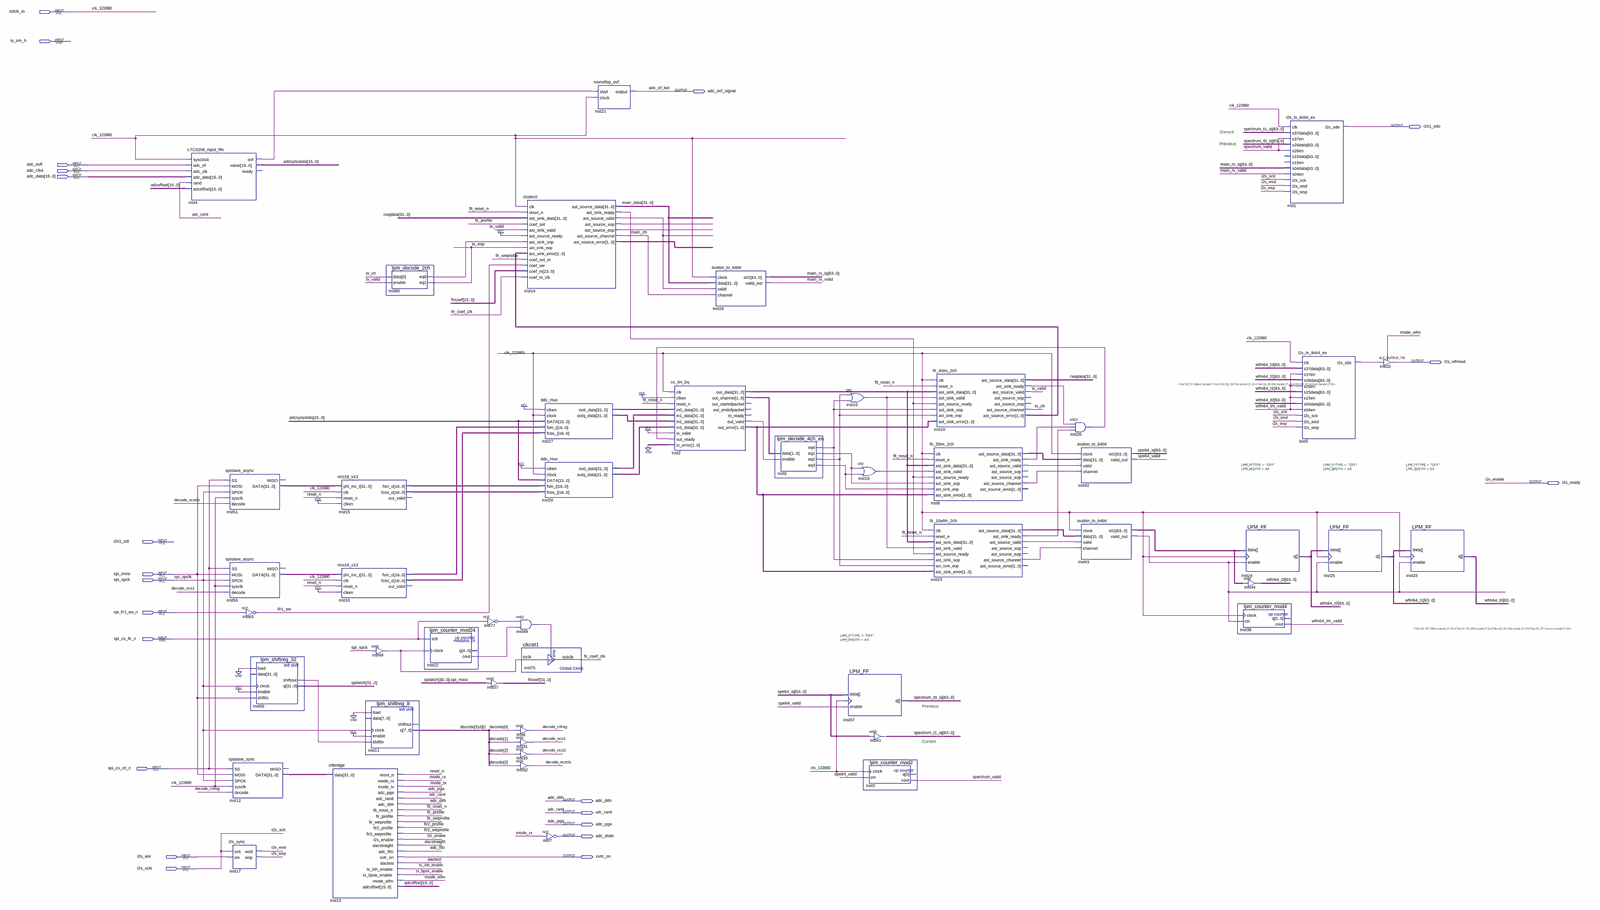
[diagram p0: schematic sheet, whole]
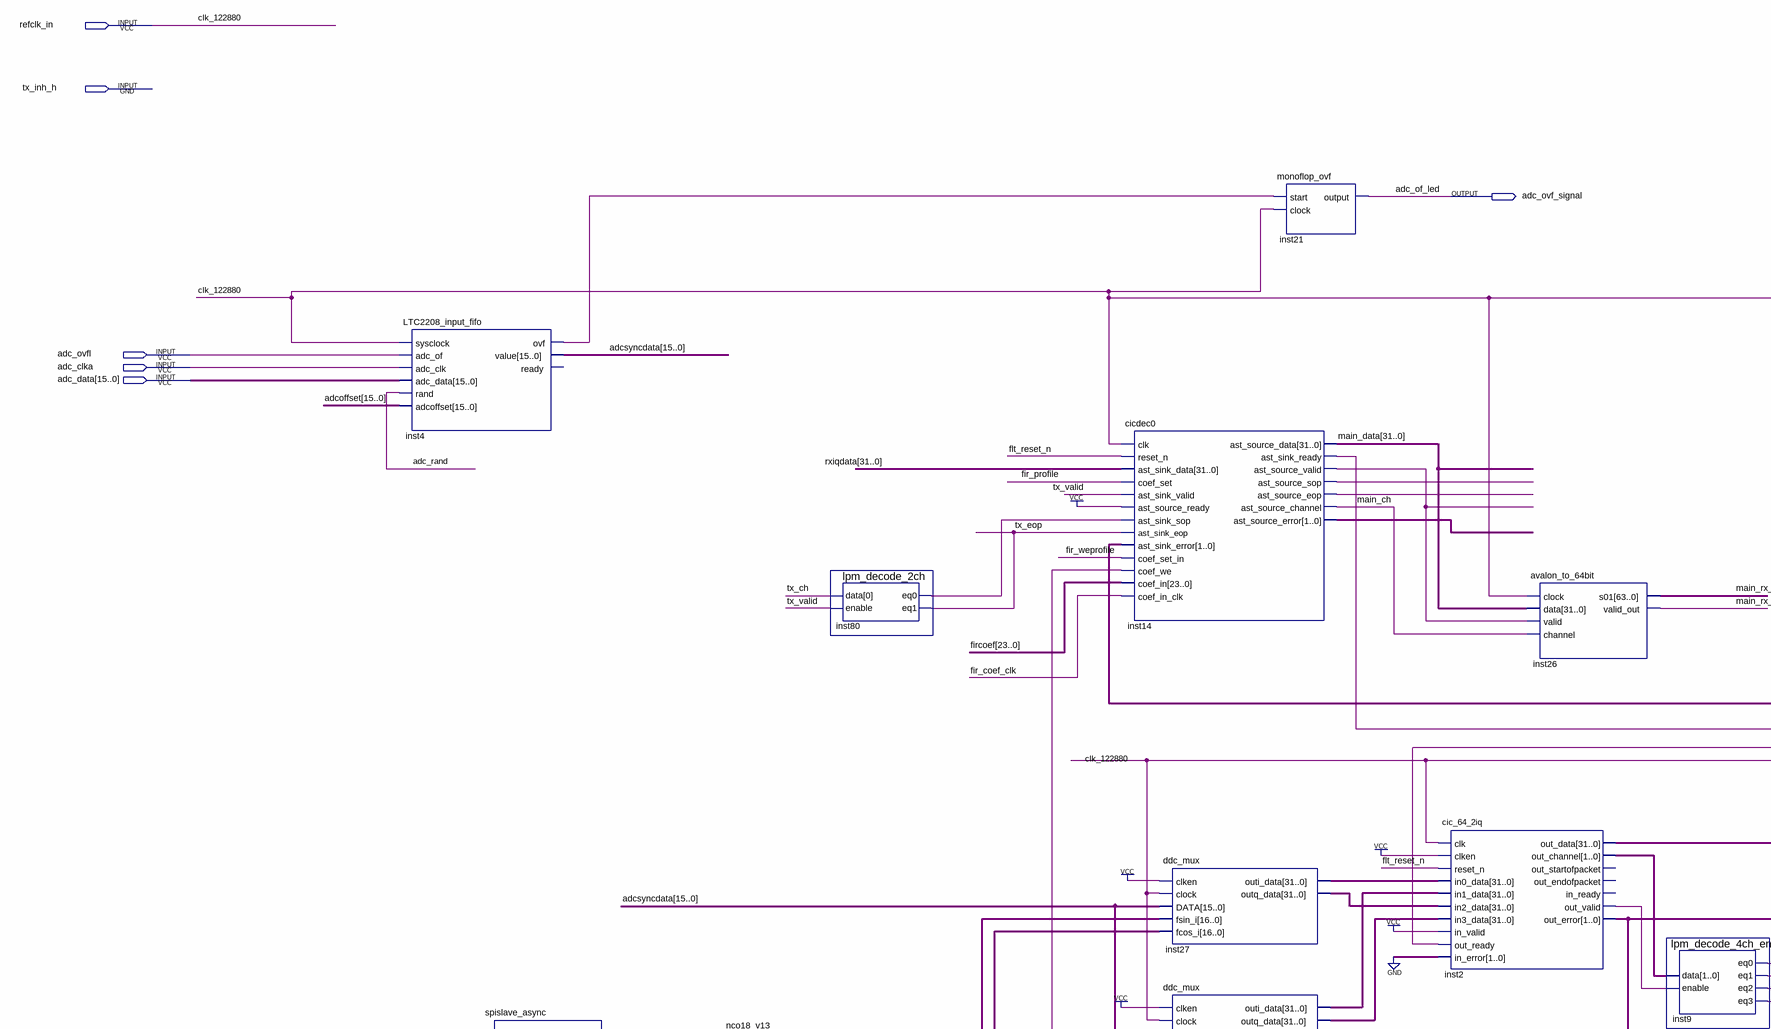
[diagram p1: schematic sheet, upper left part]
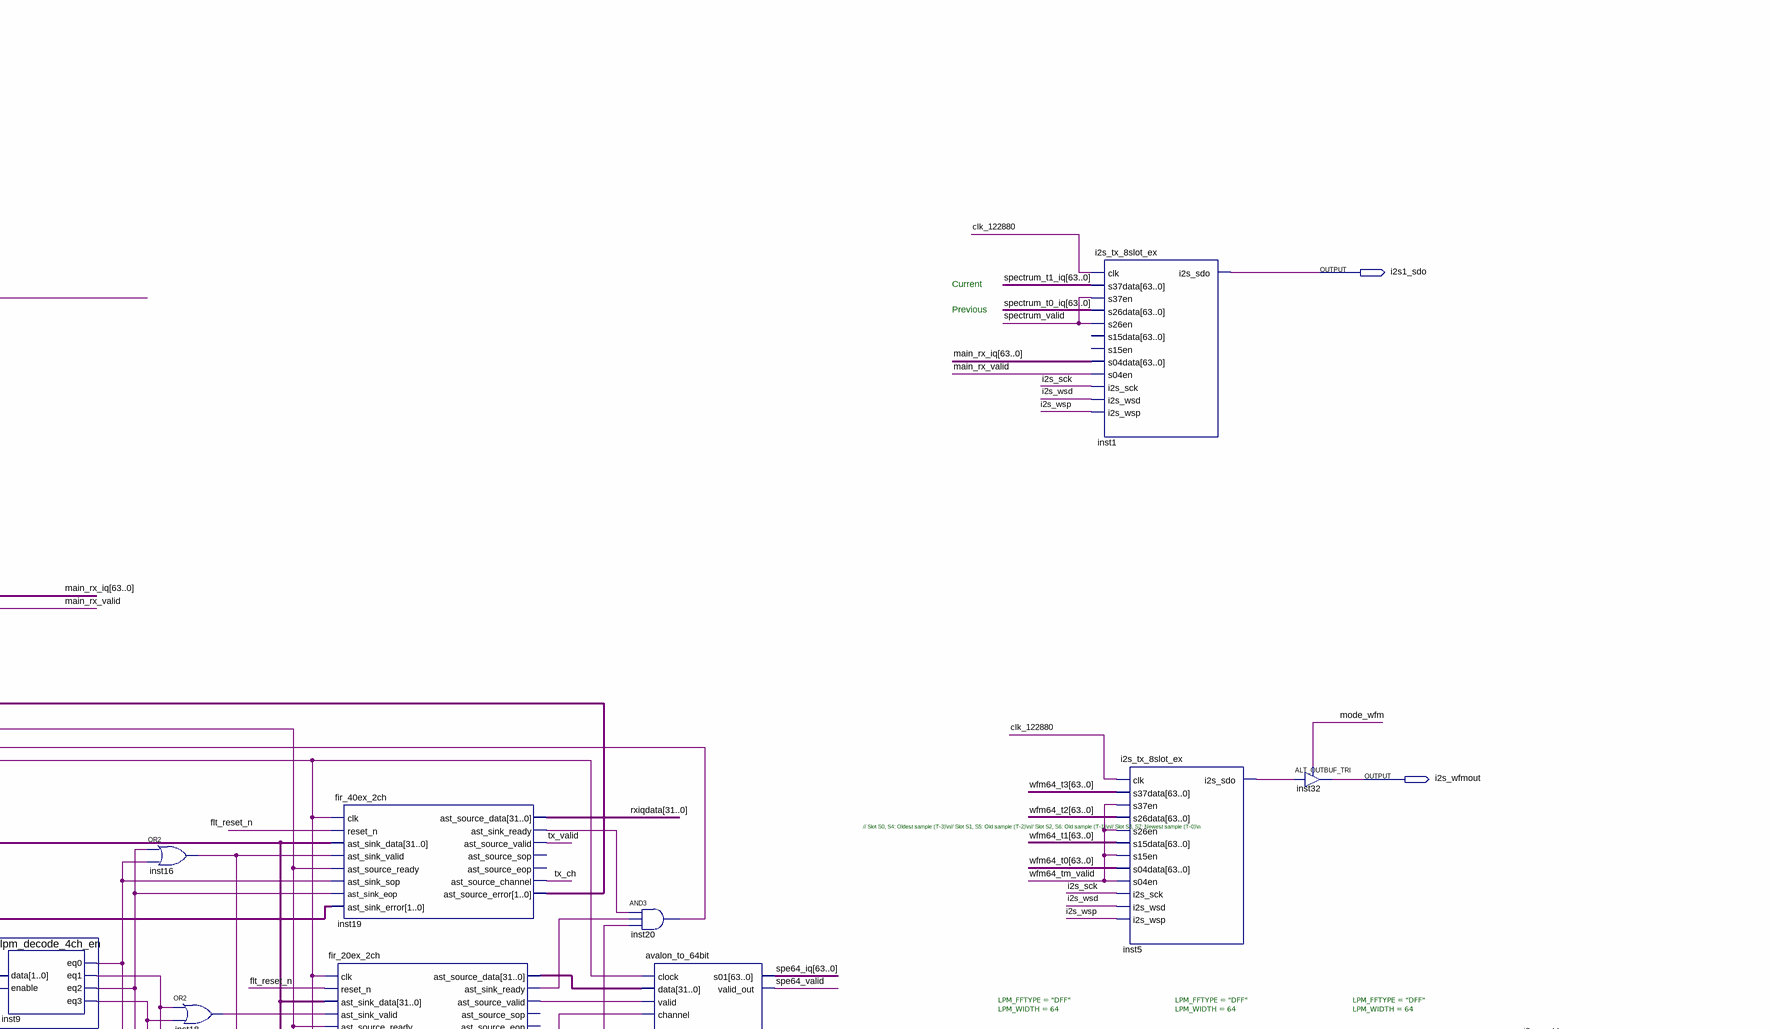
[diagram p2: schematic sheet, upper right part]
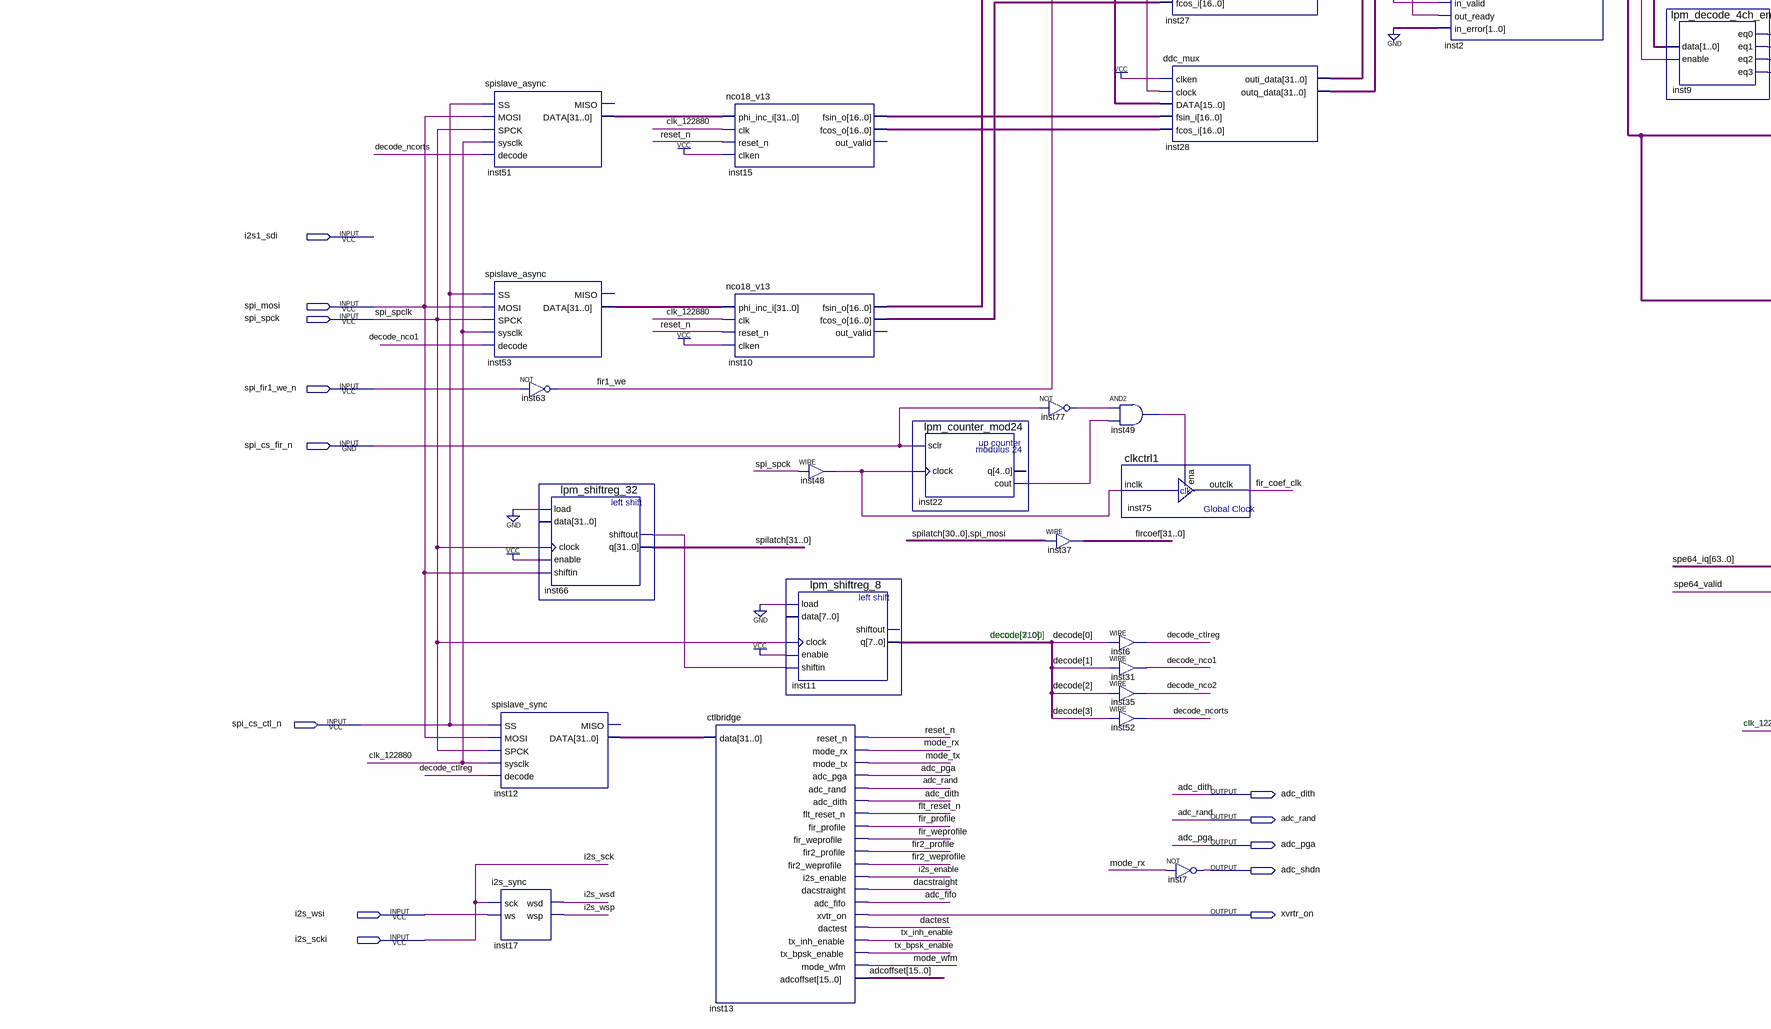
[diagram p3: schematic sheet, lower left part]
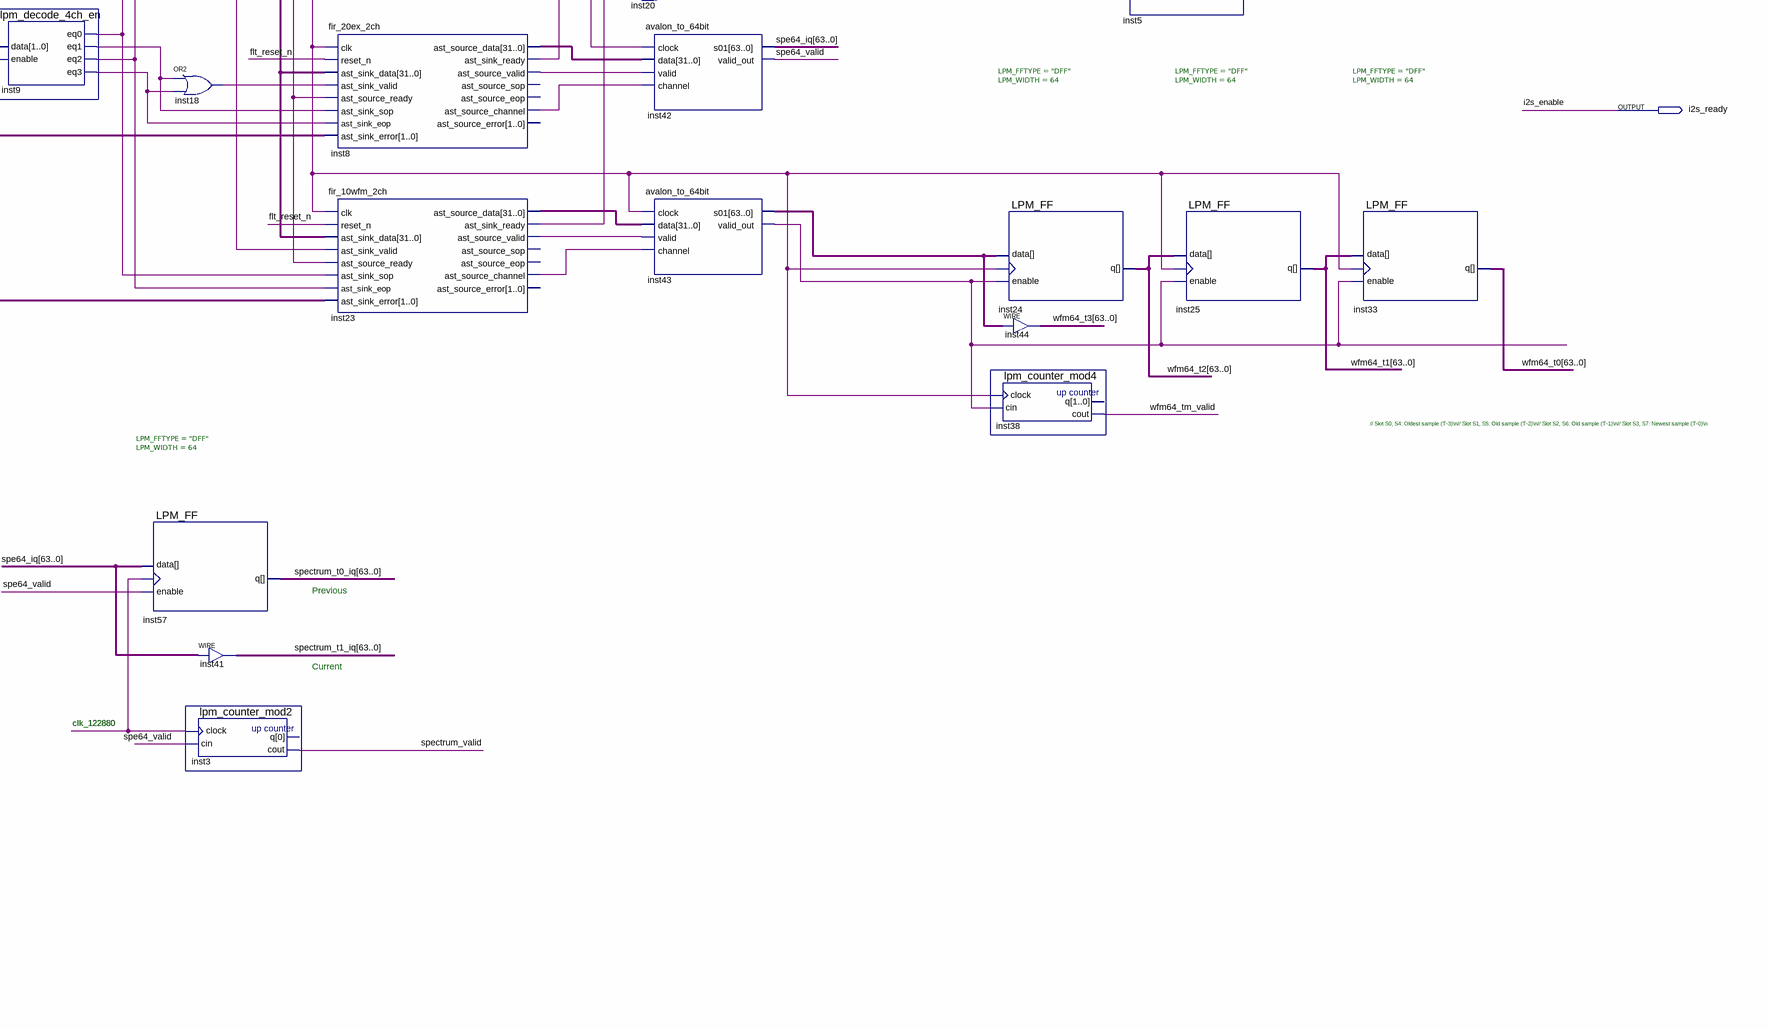
[diagram p4: schematic sheet, lower right part]
// Quartus schematic t1_1ch_wfm.bdf as structural Verilog: 49 symbols, 22 pins
module t1_1ch_wfm (
  input  refclk_in,
  input  tx_inh_h,
  input  adc_ovfl,
  input  adc_clka,
  input  [15:0] adc_data,
  input  i2s1_sdi,
  input  spi_mosi,
  input  spi_spck,
  input  spi_fir1_we_n,
  input  spi_cs_fir_n,
  input  spi_cs_ctl_n,
  input  i2s_wsi,
  input  i2s_scki,
  output adc_ovf_signal,
  output i2s1_sdo,
  output i2s_wfmout,
  output i2s_ready,
  output adc_dith,
  output adc_rand,
  output adc_pga,
  output adc_shdn,
  output xvrtr_on
);

  wire adc_fifo, dacstraight, dactest, decode_ctlreg, decode_nco1, decode_nco2, decode_ncorts, fir1_we,
       fir2_profile, fir2_weprofile, fir_coef_clk, fir_profile, fir_weprofile, flt_reset_n, i2s_wsd, i2s_wsp,
       inst2_out_valid, inst4_ovf, inst5_i2s_sdo, inst8_ast_sink_ready, inst8_ast_source_channel,
       inst8_ast_source_valid, inst9_eq0, inst9_eq1, inst9_eq2, inst9_eq3, inst14_ast_sink_ready,
       inst14_ast_source_eop, inst14_ast_source_sop, inst14_ast_source_valid, inst16_out, inst18_out,
       inst19_ast_sink_ready, inst20_out, inst22_cout, inst23_ast_sink_ready, inst23_ast_source_channel,
       inst23_ast_source_valid, inst43_valid_out, inst48_out, inst49_out, inst66_shiftout, inst77_out,
       inst80_eq0, main_ch, main_rx_valid, mode_rx, mode_tx, mode_wfm, reset_n, spe64_valid, spectrum_valid,
       tx_bpsk_enable, tx_ch, tx_eop, tx_inh_enable, tx_valid, wfm64_tm_valid;
  wire [1:0] inst2_out_channel, inst2_out_error, inst14_ast_source_error, inst19_ast_source_error;
  wire [7:0] decode;
  wire [15:0] adcoffset, adcsyncdata;
  wire [16:0] inst10_fcos_o, inst10_fsin_o, inst15_fcos_o, inst15_fsin_o;
  wire [31:0] fircoef, inst2_out_data, inst8_ast_source_data, inst12_data, inst23_ast_source_data,
       inst27_outi_data, inst27_outq_data, inst28_outi_data, inst28_outq_data, inst51_data, inst53_data,
       main_data, rxiqdata, spilatch;
  wire [63:0] inst43_s01, main_rx_iq, spe64_iq, spectrum_t0_iq, spectrum_t1_iq, wfm64_t0, wfm64_t1, wfm64_t2,
       wfm64_t3;

  LTC2208_input_fifo inst4 (
    .sysclock(refclk_in), .adc_of(adc_ovfl), .adc_clk(adc_clka), .adc_data(adc_data), .\rand (adc_rand),
    .adcoffset(adcoffset), .ovf(inst4_ovf), .value(adcsyncdata));  // open: ready
  spislave_async inst51 (
    .SS(spi_cs_ctl_n), .MOSI(spi_mosi), .SPCK(spi_spck), .sysclk(refclk_in), .decode(decode_ncorts),
    .DATA(inst51_data));  // open: MISO
  spislave_async inst53 (
    .SS(spi_cs_ctl_n), .MOSI(spi_mosi), .SPCK(spi_spck), .sysclk(refclk_in), .decode(decode_nco1),
    .DATA(inst53_data));  // open: MISO
  spislave_sync inst12 (
    .MOSI(spi_mosi), .SPCK(spi_spck), .SS(spi_cs_ctl_n), .decode(decode_ctlreg), .sysclk(refclk_in),
    .DATA(inst12_data));  // open: MISO
  i2s_sync inst17 (.sck(i2s_scki), .ws(i2s_wsi), .wsd(i2s_wsd), .wsp(i2s_wsp));
  not inst63 (fir1_we, spi_fir1_we_n);
  lpm_shiftreg_32 inst66 (
    .load(1'b0), .clock(spi_spck), .enable(1'b1), .shiftin(spi_mosi), .shiftout(inst66_shiftout), .q(spilatch));  // open: data
  ctlbridge inst13 (
    .data(inst12_data), .reset_n(reset_n), .mode_rx(mode_rx), .mode_tx(mode_tx), .adc_pga(adc_pga),
    .adc_rand(adc_rand), .adc_dith(adc_dith), .flt_reset_n(flt_reset_n), .fir_profile(fir_profile),
    .fir_weprofile(fir_weprofile), .fir2_profile(fir2_profile), .fir2_weprofile(fir2_weprofile),
    .i2s_enable(i2s_ready), .dacstraight(dacstraight), .adc_fifo(adc_fifo), .xvtr_on(xvrtr_on),
    .dactest(dactest), .tx_inh_enable(tx_inh_enable), .tx_bpsk_enable(tx_bpsk_enable), .mode_wfm(mode_wfm),
    .adcoffset(adcoffset));
  nco18_v13 inst15 (
    .phi_inc_i(inst51_data), .clk(refclk_in), .reset_n(reset_n), .clken(1'b1), .fsin_o(inst15_fsin_o),
    .fcos_o(inst15_fcos_o));  // open: out_valid
  nco18_v13 inst10 (
    .phi_inc_i(inst53_data), .clk(refclk_in), .reset_n(reset_n), .clken(1'b1), .fsin_o(inst10_fsin_o),
    .fcos_o(inst10_fcos_o));  // open: out_valid
  assign inst48_out = spi_spck;  // WIRE inst48
  lpm_shiftreg_8 inst11 (
    .load(1'b0), .clock(spi_spck), .enable(1'b1), .shiftin(inst66_shiftout), .q(decode));  // open: data, shiftout
  lpm_decode_2ch inst80 (.data(tx_ch), .enable(tx_valid), .eq0(inst80_eq0), .eq1(tx_eop));
  lpm_counter_mod24 inst22 (.sclr(spi_cs_fir_n), .clock(inst48_out), .cout(inst22_cout));  // open: q
  not inst77 (inst77_out, spi_cs_fir_n);
  assign fircoef = {spilatch[30:0], spi_mosi};  // WIRE inst37
  and inst49 (inst49_out, inst77_out, inst22_cout);
  assign decode_ctlreg = decode[0];  // WIRE inst6
  assign decode_nco1 = decode[1];  // WIRE inst31
  assign decode_nco2 = decode[2];  // WIRE inst35
  assign decode_ncorts = decode[3];  // WIRE inst52
  cicdec0 inst14 (
    .clk(refclk_in), .reset_n(flt_reset_n), .ast_sink_data(rxiqdata), .coef_set(fir_profile),
    .ast_sink_valid(tx_valid), .ast_source_ready(1'b1), .ast_sink_sop(inst80_eq0), .ast_sink_eop(tx_eop),
    .ast_sink_error(inst19_ast_source_error), .coef_set_in(fir_weprofile), .coef_we(fir1_we),
    .coef_in(fircoef[23:0]), .coef_in_clk(fir_coef_clk), .ast_source_data(main_data),
    .ast_sink_ready(inst14_ast_sink_ready), .ast_source_valid(inst14_ast_source_valid),
    .ast_source_sop(inst14_ast_source_sop), .ast_source_eop(inst14_ast_source_eop),
    .ast_source_channel(main_ch), .ast_source_error(inst14_ast_source_error));
  ddc_mux inst27 (
    .clken(1'b1), .clock(refclk_in), .DATA(adcsyncdata), .fsin_i(inst10_fsin_o), .fcos_i(inst10_fcos_o),
    .outi_data(inst27_outi_data), .outq_data(inst27_outq_data));
  ddc_mux inst28 (
    .clken(1'b1), .clock(refclk_in), .DATA(adcsyncdata), .fsin_i(inst15_fsin_o), .fcos_i(inst15_fcos_o),
    .outi_data(inst28_outi_data), .outq_data(inst28_outq_data));
  clkctrl1 inst75 (.inclk(inst48_out), .ena(inst49_out), .outclk(fir_coef_clk));
  not inst7 (adc_shdn, mode_rx);
  monoflop_ovf inst21 (.start(inst4_ovf), .clock(refclk_in), .\output (adc_ovf_signal));
  cic_64_2iq inst2 (
    .clk(refclk_in), .clken(1'b1), .reset_n(flt_reset_n), .in0_data(inst27_outi_data),
    .in1_data(inst28_outi_data), .in2_data(inst27_outq_data), .in3_data(inst28_outq_data), .in_valid(1'b1),
    .out_ready(inst20_out), .in_error(2'b00), .out_data(inst2_out_data), .out_channel(inst2_out_channel),
    .out_valid(inst2_out_valid), .out_error(inst2_out_error));  // open: out_startofpacket, out_endofpacket, in_ready
  avalon_to_64bit inst26 (
    .clock(refclk_in), .data(main_data), .valid(inst14_ast_source_valid), .channel(main_ch),
    .s01(main_rx_iq), .valid_out(main_rx_valid));
  lpm_decode_4ch_en inst9 (
    .data(inst2_out_channel), .enable(inst2_out_valid), .eq0(inst9_eq0), .eq1(inst9_eq1), .eq2(inst9_eq2),
    .eq3(inst9_eq3));
  or inst16 (inst16_out, inst9_eq2, inst9_eq0);
  LPM_FF #(.LPM_FFTYPE("DFF"), .LPM_WIDTH(64)) inst57 (
    .clock(refclk_in), .data(spe64_iq), .enable(spe64_valid), .q(spectrum_t0_iq));
  or inst18 (inst18_out, inst9_eq1, inst9_eq3);
  assign spectrum_t1_iq = spe64_iq;  // WIRE inst41
  lpm_counter_mod2 inst3 (.clock(refclk_in), .cin(spe64_valid), .cout(spectrum_valid));  // open: q
  fir_40ex_2ch inst19 (
    .clk(refclk_in), .reset_n(flt_reset_n), .ast_sink_data(inst2_out_data), .ast_sink_valid(inst16_out),
    .ast_source_ready(inst14_ast_sink_ready), .ast_sink_sop(inst9_eq0), .ast_sink_eop(inst9_eq2),
    .ast_sink_error(inst2_out_error), .ast_source_data(rxiqdata), .ast_sink_ready(inst19_ast_sink_ready),
    .ast_source_valid(tx_valid), .ast_source_channel(tx_ch), .ast_source_error(inst19_ast_source_error));  // open: ast_source_sop, ast_source_eop
  fir_20ex_2ch inst8 (
    .clk(refclk_in), .reset_n(flt_reset_n), .ast_sink_data(inst2_out_data), .ast_sink_valid(inst18_out),
    .ast_source_ready(inst14_ast_sink_ready), .ast_sink_sop(inst9_eq1), .ast_sink_eop(inst9_eq3),
    .ast_sink_error(inst2_out_error), .ast_source_data(inst8_ast_source_data),
    .ast_sink_ready(inst8_ast_sink_ready), .ast_source_valid(inst8_ast_source_valid),
    .ast_source_channel(inst8_ast_source_channel));  // open: ast_source_sop, ast_source_eop, ast_source_error
  fir_10wfm_2ch inst23 (
    .clk(refclk_in), .reset_n(flt_reset_n), .ast_sink_data(inst2_out_data), .ast_sink_valid(inst16_out),
    .ast_source_ready(inst14_ast_sink_ready), .ast_sink_sop(inst9_eq0), .ast_sink_eop(inst9_eq2),
    .ast_sink_error(inst2_out_error), .ast_source_data(inst23_ast_source_data),
    .ast_sink_ready(inst23_ast_sink_ready), .ast_source_valid(inst23_ast_source_valid),
    .ast_source_channel(inst23_ast_source_channel));  // open: ast_source_sop, ast_source_eop, ast_source_error
  and inst20 (inst20_out, inst19_ast_sink_ready, inst8_ast_sink_ready, inst23_ast_sink_ready);
  avalon_to_64bit inst42 (
    .clock(refclk_in), .data(inst8_ast_source_data), .valid(inst8_ast_source_valid),
    .channel(inst8_ast_source_channel), .s01(spe64_iq), .valid_out(spe64_valid));
  avalon_to_64bit inst43 (
    .clock(refclk_in), .data(inst23_ast_source_data), .valid(inst23_ast_source_valid),
    .channel(inst23_ast_source_channel), .s01(inst43_s01), .valid_out(inst43_valid_out));
  LPM_FF #(.LPM_FFTYPE("DFF"), .LPM_WIDTH(64)) inst24 (
    .enable(inst43_valid_out), .clock(refclk_in), .data(inst43_s01), .q(wfm64_t2));
  assign wfm64_t3 = inst43_s01;  // WIRE inst44
  lpm_counter_mod4 inst38 (.clock(refclk_in), .cin(inst43_valid_out), .cout(wfm64_tm_valid));  // open: q
  i2s_tx_8slot_ex inst1 (
    .clk(refclk_in), .s37data(spectrum_t1_iq), .s37en(spectrum_valid), .s26data(spectrum_t0_iq),
    .s26en(spectrum_valid), .s04data(main_rx_iq), .s04en(main_rx_valid), .i2s_sck(i2s_scki),
    .i2s_wsd(i2s_wsd), .i2s_wsp(i2s_wsp), .i2s_sdo(i2s1_sdo));  // open: s15data, s15en
  i2s_tx_8slot_ex inst5 (
    .clk(refclk_in), .s37data(wfm64_t3), .s37en(wfm64_tm_valid), .s26data(wfm64_t2), .s26en(wfm64_tm_valid),
    .s15data(wfm64_t1), .s15en(wfm64_tm_valid), .s04data(wfm64_t0), .s04en(wfm64_tm_valid),
    .i2s_sck(i2s_scki), .i2s_wsd(i2s_wsd), .i2s_wsp(i2s_wsp), .i2s_sdo(inst5_i2s_sdo));
  LPM_FF #(.LPM_FFTYPE("DFF"), .LPM_WIDTH(64)) inst25 (
    .enable(inst43_valid_out), .clock(refclk_in), .data(wfm64_t2), .q(wfm64_t1));
  ALT_OUTBUF_TRI inst32 (.i(inst5_i2s_sdo), .oe(mode_wfm), .o(i2s_wfmout));
  LPM_FF #(.LPM_FFTYPE("DFF"), .LPM_WIDTH(64)) inst33 (
    .enable(inst43_valid_out), .clock(refclk_in), .data(wfm64_t1), .q(wfm64_t0));

  // Other names for the same wires on the sheet: adc_of_led = adc_ovf_signal; clk_122880 = refclk_in;
  //   i2s_enable = i2s_ready; i2s_sck = i2s_scki; spi_spclk = spi_spck

  // Notes on the sheet:
  //   Current
  //   Previous
  //   // Slot S0, S4: Oldest sample (T-3)\n// Slot S1, S5: Old sample (T-2)\n// Slot S2, S6: Old sample (T-1)\n// Slot S3, S7: Newest sample (T-0)\n
  //   // Slot S0, S4: Oldest sample (T-3)\n// Slot S1, S5: Old sample (T-2)\n// Slot S2, S6: Old sample (T-1)\n// Slot S3, S7: Newest sample (T-0)\n
  //   Previous
  //   decode[31..0]
  //   Current
  //   clk_122880
endmodule
